# EasyEDA Pro project attenuator_evb.eprj

# Schematic Schematic1
Create Date: 2024-03-21; Page Name: P1; Project Name: attenuator_evb; Schematic Name: Schematic1; Update Date: 2024-04-02; Company: EasyEDA.com; Drawn: EasyEDA; Page Size: A4; Part Number: JLCPCB-002; Reviewed: EasyEDA; Version: V0.1
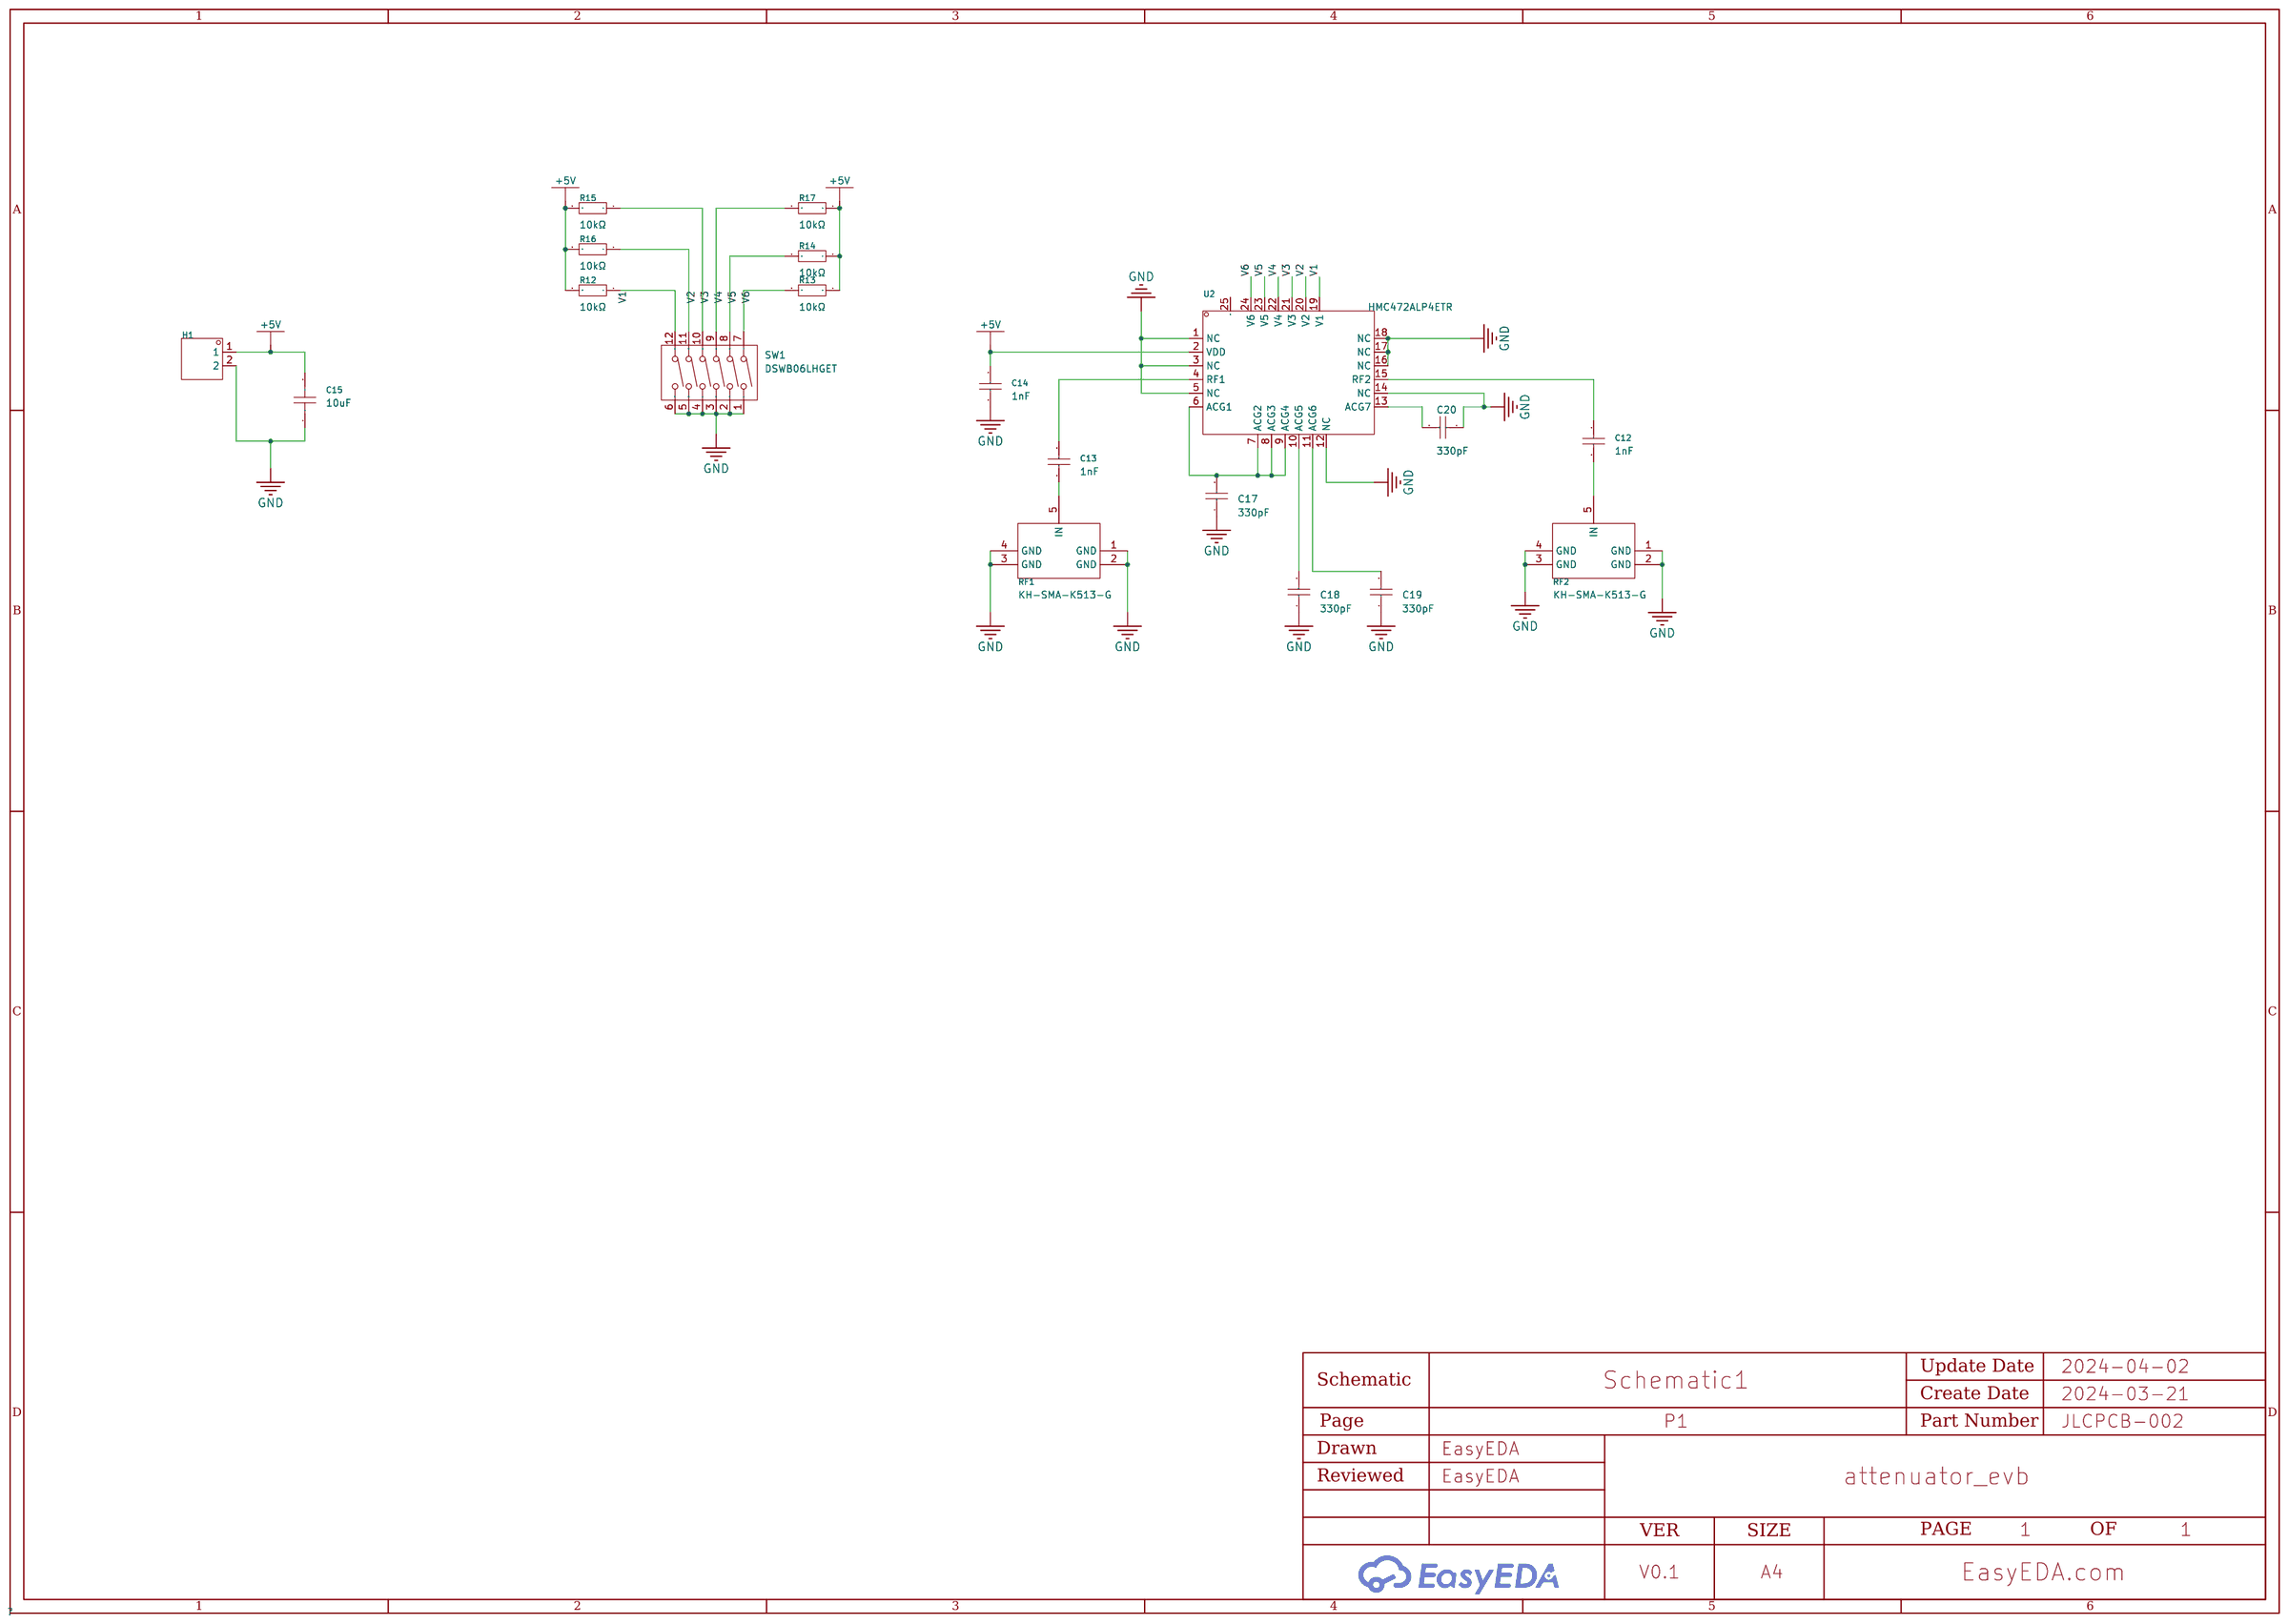
[diagram p0: schematic sheet]

## Parts
C12  1nF  [C0402]
C13  1nF  [C0402]
C14  1nF  [C0402]
C15  10uF  [C0603]
C17  330pF  [C0603]
C18  330pF  [C0603]
C19  330pF  [C0603]
C20  330pF  [C0603]
H1  -  [HDR-TH_2P-P2.54-V-M-1]  (no BOM)
R12  10kΩ  [R0603]
R13  10kΩ  [R0603]
R14  10kΩ  [R0603]
R15  10kΩ  [R0603]
R16  10kΩ  [R0603]
R17  10kΩ  [R0603]
RF1  KH-SMA-K513-G  [ANT-TH_KH-SMA-K513-G]
RF2  KH-SMA-K513-G  [ANT-TH_KH-SMA-K513-G]
SW1  DSWB06LHGET  [SW-TH_DSWB06LHGET]
U2  HMC472ALP4ETR  [QFN-24_L4.0-W4.0-P0.50-TL-EP2.7]

## Library data of the parts
C12-C14 = CC0402KRX7R9BB102: Capacitance: Tolerance:±10% Tolerance:±10% Voltage Rated: Temperature Coefficient:; LCSC Part Name: 1nF ±10% 50V; Supplier Part: C106205; Manufacturer: YAGEO(国巨); Supplier Footprint: 0402; JLCPCB Part Class: Extended Part; Datasheet: https://atta.szlcsc.com/upload/public/pdf/source/20181008/C309510_22F155564471FAF6A489F7D68F34234E.pdf; Supplier: LCSC; Tolerance: ±10%
C15 = CL10A106MP8NNNC: Capacitance: Tolerance:±20% Tolerance:±20% Voltage Rated: Temperature Coefficient:; LCSC Part Name: 10uF ±20% 10V; Supplier Part: C85713; Manufacturer: SAMSUNG(三星); Supplier Footprint: 0603; JLCPCB Part Class: Extended Part; Datasheet: https://atta.szlcsc.com/upload/public/pdf/source/20160218/1457707763339.pdf; Supplier: LCSC; Tolerance: ±20%
C17-C20 = 0603B331K500NT: Capacitance: Tolerance:±10% Tolerance:±10% Voltage Rated: Temperature Coefficient:; LCSC Part Name: 330pF ±10% 50V; Supplier Part: C1612; Manufacturer: FH(风华); Supplier Footprint: 0603; JLCPCB Part Class: Extended Part; Datasheet: https://atta.szlcsc.com/upload/public/pdf/source/20200305/C486355_26A10D38EF8C2A5C37091D0039909270.pdf; Supplier: LCSC; Tolerance: ±10%
H1 = HDR-M_2.54_1x2P: Supplier Footprint: Through
R12-R17 = 0603WAF1002T5E: Type:Thick Film Resistors Resistance:10kΩ Tolerance:±1% Tolerance:±1% Power(Watts): Overload Voltage (Max): Temperature Coefficient:±100ppm/℃ Temperature Coefficient:±100ppm/℃ Operating Temperature Range:-55℃~+155℃ Operating Temperature Range:-55℃~+155℃; LCSC Part Name: 厚膜电阻 10kΩ ±1% 100mW; Supplier Part: C25804; Manufacturer: UNI-ROYAL(厚声); Supplier Footprint: 0603; JLCPCB Part Class: Basic Part; Datasheet: https://atta.szlcsc.com/upload/public/pdf/source/20200306/C422600_1E6D84923E4A46A82E41ADD87F860B5C.pdf; Supplier: LCSC; Type: Thick Film Resistors; Tolerance: ±1%; Temperature Coefficient: ±100ppm/℃; Operating Temperature Range: -55℃~+155℃
RF1 RF2 = KH-SMA-K513-G: Connector Type:板端 Interface Type:内孔 Number of Ports:1 Interface Diameter:- Interface Length/Height:- Frequency-Max:6GHz RF Series:SMA Impedance:50Ω Style:弯头 Operating Temperature Range:-55℃~+155℃ Operating Temperature Range:-55℃~+155℃; LCSC Part Name: SMA 内孔 弯头; Supplier Part: C411575; Manufacturer: kinghelm(金航标); Supplier Footprint: 插件; JLCPCB Part Class: Extended Part; Datasheet: https://atta.szlcsc.com/upload/public/pdf/source/20210317/C411575_49039CD64129040639EC5218E5A2C783.pdf; Supplier: LCSC; Connector Type: 板端; Interface Type: 内孔; Number of Ports: 1; Frequency-Max: 6GHz; RF Series: SMA; Impedance: 50Ω; Style: 弯头; Operating Temperature Range: -55℃~+155℃
SW1 = DSWB06LHGET: Type:平拨,凸起式 Circuit:SPST Number of Positions:6Bit Lead Pitch:2.54mm Operating Life:- Color:Red; LCSC Part Name: 拨码开关,平拨开关,DSWB06LHGET; Supplier Part: C99416; Manufacturer: YE; Supplier Footprint: 插件; JLCPCB Part Class: Extended Part; Datasheet: https://atta.szlcsc.com/upload/public/pdf/source/20170330/1490855795233.pdf; Supplier: LCSC; Type: 平拨,凸起式; Circuit: SPST; Number of Positions: 6Bit; Lead Pitch: 2.54mm; Color: Red
U2 = HMC472ALP4ETR: Frequency Range:0Hz~3.8GHz Frequency Range:0Hz~3.8GHz Power (Watts):560mW Impedance:50Ω Attenuation Value:0.5dB~31.5dB Attenuation Value:0.5dB~31.5dB Operating Temperature:-40℃~+85℃ Operating Temperature:-40℃~+85℃; LCSC Part Name: 宽带6位 GaAs IC数字衰减器; Supplier Part: C208585; Manufacturer: ADI(亚德诺); Supplier Footprint: QFN-24-EP(4x4); JLCPCB Part Class: Extended Part; Datasheet: https://atta.szlcsc.com/upload/public/pdf/source/20180416/C209364_D034942268ABB16FFE091F729F253F30.pdf; Supplier: LCSC; Frequency Range: 0Hz~3.8GHz; Power (Watts): 560mW; Impedance: 50Ω; Attenuation Value: 0.5dB~31.5dB; Operating Temperature: -40℃~+85℃

## Nets
+5V: C14.2 C15.2 H1.1 R12.2 R13.1 R14.1 R15.2 R16.2 R17.1 U2.2(VDD)
GND: C14.1 C15.1 C17.1 C18.1 C19.1 C20.1 H1.2 RF1.1(GND) RF1.2(GND) RF1.3(GND) RF1.4(GND) RF2.1(GND) RF2.2(GND) RF2.3(GND) RF2.4(GND) SW1.1 SW1.2 SW1.3 SW1.4 SW1.5 SW1.6 U2.1(NC) U2.3(NC) U2.5(NC) U2.12(NC) U2.14(NC) U2.16(NC) U2.17(NC) U2.18(NC)
V1: R12.1 SW1.12 U2.19(V1)
V2: R16.1 SW1.11 U2.20(V2)
V3: R15.1 SW1.10 U2.21(V3)
V4: R17.2 SW1.9 U2.22(V4)
V5: R14.2 SW1.8 U2.23(V5)
V6: R13.2 SW1.7 U2.24(V6)
$1N3362: C13.1 RF1.5(IN)
$1N3366: C13.2 U2.4(RF1)
$1N3370: C12.2 U2.15(RF2)
$1N3377: C12.1 RF2.5(IN)
$1N10696: C17.2 U2.6(ACG1) U2.7(ACG2) U2.8(ACG3) U2.9(ACG4)
$1N10794: C18.2 U2.10(ACG5)
$1N10806: C19.2 U2.11(ACG6)
$1N10842: C20.2 U2.13(ACG7)

Not connected (* = marked no-connect by the designer): U2 25

# Board PCB1
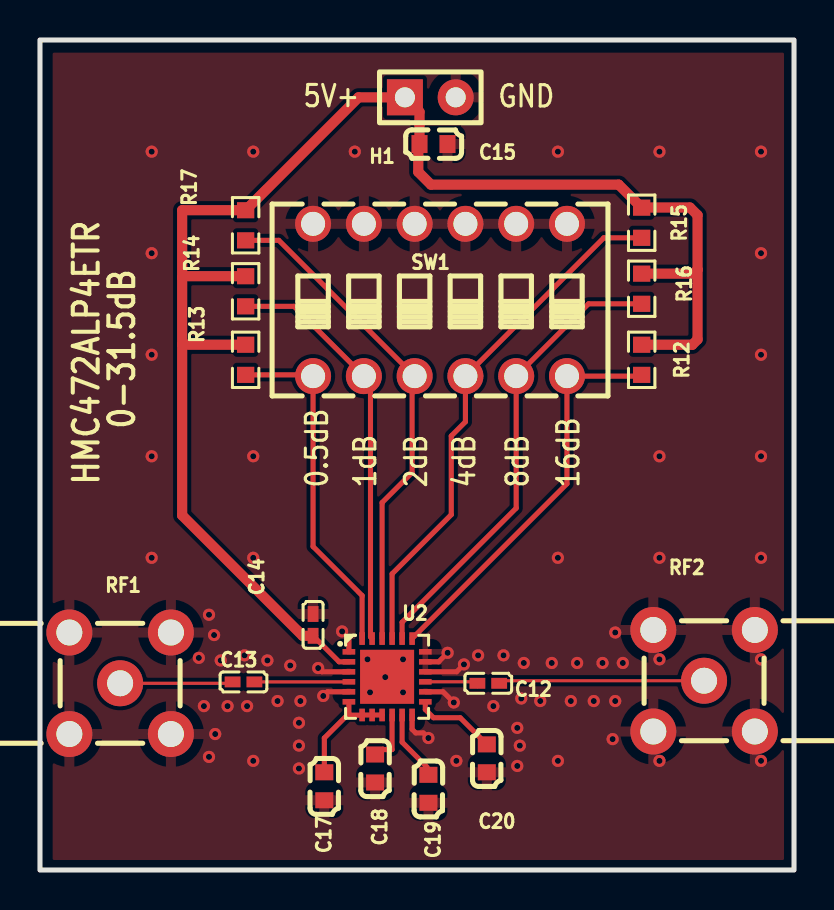
[diagram p1: board, top side]
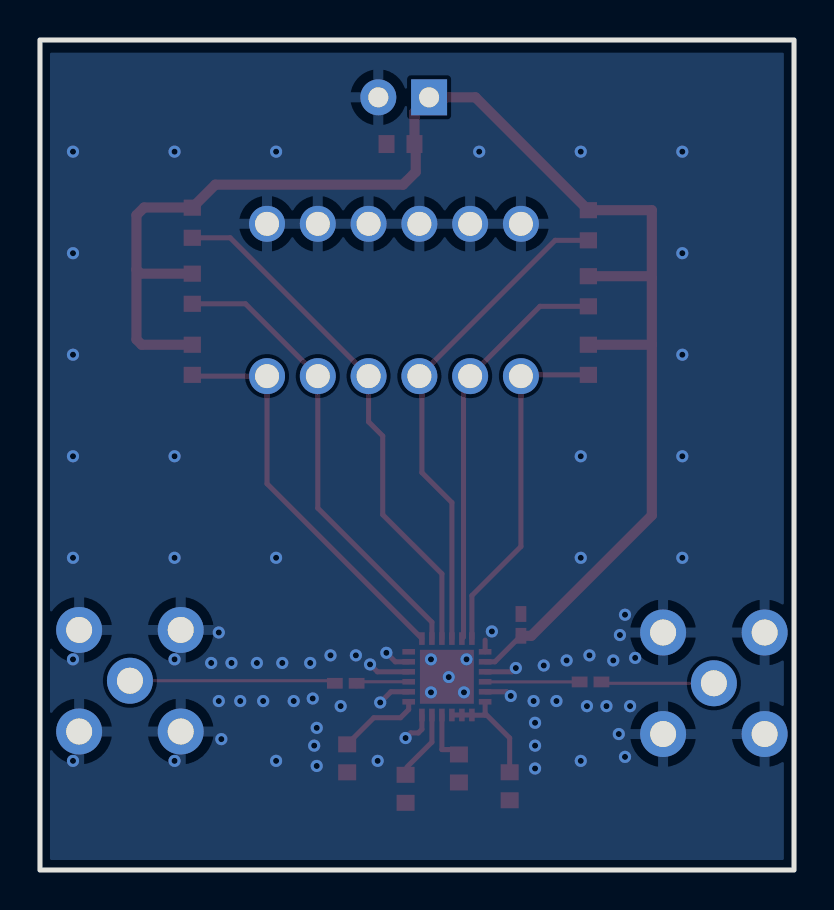
[diagram p2: board, bottom side, seen from below]

Outline 37.72 x 41.53 mm; copper layers: Top Layer, Inner1, Inner2, Bottom Layer. Coordinates in mm from the lower left corner of the outline.
Outline path: rectangle 0,41.53 37.72,0
Stack: Top Layer 0.035mm 外层铜厚1oz / Dielectric1 0.0994mm 3313 RC57% 4.2mil / Inner1 0.0152mm 内层铜厚 / Dielectric2 1.265mm 1.3mm H/HOZ 含铜 / Inner2 0.0152mm 内层铜厚 / Dielectric3 0.0994mm 3313 RC57% 4.2mil / Bottom Layer 0.035mm 外层铜厚1oz

## Design rules (mm)
template: JLCPCB Capability(Two Layers Board)
spacing copperThickness1oz (default): track to track 0.102, other pairs 0.152 to 0.3
spacing copperThickness2oz: track to track 0.203, other pairs 0.152 to 0.3
track width copperThickness1oz (default): min 0.127, default 0.254, max 2.54
track width copperThickness2oz: min 0.203, default 0.254, max 2.54
differential pair differentialPair (default): width min 0.127, default 0.254, max 2.54; gap min 0.152, default 0.152
via viaSize (default): diameter min 0.5, default 0.61, max 10; hole min 0.3, default 0.305, max 6.3

## Placement (name value [footprint] x y rotation side)
C12  1nF  [C0402]  22.42 9.34 180 top
C13  1nF  [C0402]  10.18 9.41 0 top
C14  1nF  [C0402]  13.66 12.26 270 top
C15  10uF  [C0603]  19.69 36.32 180 top
C17  330pF  [C0603]  14.22 4.19 90 top
C18  330pF  [C0603]  16.76 5.08 90 top
C19  330pF  [C0603]  19.43 4.06 90 top
C20  330pF  [C0603]  22.35 5.59 90 top
H1  -  [HDR-TH_2P-P2.54-V-M-1]  19.53 38.66 0 top
R12  10kΩ  [R0603]  30.1 25.53 90 top
R13  10kΩ  [R0603]  10.29 25.53 270 top
R14  10kΩ  [R0603]  10.29 28.96 270 top
R15  10kΩ  [R0603]  30.1 32.39 90 top
R16  10kΩ  [R0603]  30.1 29.08 90 top
R17  10kΩ  [R0603]  10.29 32.26 270 top
RF1  KH-SMA-K513-G  [ANT-TH_KH-SMA-K513-G]  4.01 9.34 0 top
RF2  KH-SMA-K513-G  [ANT-TH_KH-SMA-K513-G]  33.22 9.47 180 top
SW1  DSWB06LHGET  [SW-TH_DSWB06LHGET]  20.01 28.52 0 top
U2  HMC472ALP4ETR  [QFN-24_L4.0-W4.0-P0.50-TL-EP2.7]  17.36 9.67 0 top

## Footprints (pads in the part's own frame, mm; a bottom-side part is the same pattern mirrored in y, then rotated)
ANT-TH_KH-SMA-K513-G
  round 2.3 hole 1.3: 1(-2.54,-2.54) 2(-2.54,2.54) 3(2.54,2.54) 4(2.54,-2.54) 5(0,0)
C0402
  rect 0.79x0.54 smd: 1(-0.545,0) 2(0.545,0)
C0603
  rect 0.8x0.9 smd: 1(-0.7,0) 2(0.7,0)
HDR-TH_2P-P2.54-V-M-1
  rect 1.8x1.8 hole 1: 1(-1.27,0)
  round 1.8 hole 1: 2(1.27,0)
QFN-24_L4.0-W4.0-P0.50-TL-EP2.7
  rect 0.633x0.28 smd: 1(-1.911,1.25) 2(-1.911,0.75) 3(-1.911,0.25) 4(-1.911,-0.25) 5(-1.911,-0.75) 6(-1.911,-1.25) 13(1.911,-1.25) 14(1.911,-0.75) 15(1.911,-0.25) 16(1.911,0.25) 17(1.911,0.75) 18(1.911,1.25)
  rect 0.28x0.633 smd: 7(-1.25,-1.911) 8(-0.75,-1.911) 9(-0.25,-1.911) 10(0.25,-1.911) 11(0.75,-1.911) 12(1.25,-1.911) 19(1.25,1.911) 20(0.75,1.911) 21(0.25,1.911) 22(-0.25,1.911) 23(-0.75,1.911) 24(-1.25,1.911)
  rect 2.7x2.7 smd: 25(0,0)
R0603
  rect 0.806x0.864 smd: 1(-0.753,0) 2(0.753,0)
SW-TH_DSWB06LHGET
  round 1.8 hole 1.2: 1(-6.35,3.81) 2(-3.81,3.81) 3(-1.27,3.81) 4(1.27,3.81) 5(3.81,3.81) 6(6.35,3.81) 7(-6.35,-3.81) 8(-3.81,-3.81) 9(-1.27,-3.81) 10(1.27,-3.81) 11(3.81,-3.81) 12(6.35,-3.81)

## Nets
As in the schematic.

Pads without a net: U2 25

## Via types
v1: diameter 0.61, hole 0.305, Top Layer to Bottom Layer, 73 vias

## Routing (per net, layer and track width the routed paths; a pad name or vN(x,y) marks a point on that pad's centre or on a via; arc(x,y) is an arc through that point)
+5V: length 77.2
  Top Layer w0.254: 15.45,10.42 14.96,10.42 C14.2
  Top Layer w0.508: 32.89,30.04 32.89,26.54 32.63,26.28 R12.2 ; 32.89,30.04 32.69,29.84 R16.2 ; 32.89,30.04 32.89,32.77 32.51,33.15 30.11,33.15 R15.2 28.95,34.29 19.56,34.29 18.92,34.93 18.92,36.09 18.95,36.12 ; R14.1 7.19,29.71 7.11,29.63 ; R13.1 7.12,26.28 7.11,26.29 ; 7.11,29.63 7.11,26.29 ; 7.11,29.63 7.11,33.01 R17.1 15.93,38.66 H1.1 18.98,37.93 C15.2 ; 7.11,26.29 7.11,17.74 13.14,11.72 C14.2
GND: length 10.3
  Top Layer w0.254: U2.16 20.84,9.92 v1(21.21,10.29) ; 15.45,8.92 14.38,8.92 v1(14.17,8.71) ; 15.45,10.92 15.45,11.5 ; U2.17 19.94,10.42 v1(20.39,10.87) ; v1(13.92,10.11) 14.1,9.92 15.45,9.92 ; U2.14 20.16,8.92 v1(20.7,8.38) ; 18.61,7.76 18.61,7.04 18.8,6.86 19.18,6.86 v1(19.43,6.6)
  vias: v1(5.59,35.94) v1(5.59,30.86) v1(5.59,25.78) v1(5.59,20.7) v1(5.59,15.62) v1(7.95,10.61) v1(8.2,8.2) v1(8.45,12.77) v1(8.45,5.66) v1(8.71,11.76) v1(8.77,6.8) v1(9.04,10.49) v1(9.38,8.2) v1(10.23,10.74) v1(10.36,8.2) v1(10.67,35.94) v1(10.67,20.7) v1(10.67,15.62) v1(10.67,5.46) v1(11.38,10.49) v1(11.88,8.45) v1(12.52,10.23) v1(13.03,8.45) v1(12.95,7.37) v1(12.95,6.22) v1(12.95,5.08) v1(15.11,11.94) v1(15.75,35.94) v1(16.38,10.54) v1(16.51,8.89) v1(17.27,9.65) v1(18.16,10.54) v1(18.16,8.89) v1(20.83,5.46) v1(21.92,10.74) v1(22.68,8.2) v1(23.19,10.74) v1(23.88,7.11) v1(23.88,5.21) v1(24,6.22) v1(24.08,8.58) v1(24.2,10.36) v1(25.03,8.45) v1(25.6,10.36) v1(25.91,35.94) v1(25.91,15.62) v1(25.91,5.46) v1(26.56,8.45) v1(26.87,10.36) v1(27.7,8.45) v1(28.14,10.36) v1(28.65,6.55) v1(28.77,11.88) v1(28.77,8.45) v1(29.16,10.36) v1(30.99,35.94) v1(30.99,20.7) v1(30.99,15.62) v1(30.99,10.54) v1(30.99,5.46) v1(36.07,35.94) v1(36.07,30.86) v1(36.07,25.78) v1(36.07,20.7) v1(36.07,15.62) v1(36.07,10.54) v1(36.07,5.46)
V1: length 20.1
  Top Layer w0.254: 18.61,11.58 26.36,19.33 SW1.12 30.04,24.71 R12.1
V2: length 23.3
  Top Layer w0.254: U2.20 18.11,12.4 23.82,18.11 SW1.11 27.44,28.33 R16.1
V3: length 26.2
  Top Layer w0.254: 29.97,31.63 28.2,31.63 SW1.10 21.28,22.42 20.57,21.72 20.57,17.78 17.61,14.82 17.61,11.58
V4: length 25.1
  Top Layer w0.254: R17.2 11.95,31.5 SW1.9 18.61,24.58 18.61,19.88 17.11,18.38 U2.22
V5: length 20.7
  Top Layer w0.254: 16.61,11.58 16.53,11.66 16.53,24.38 SW1.8 12.71,28.2 R14.2
V6: length 17.5
  Top Layer w0.254: R13.2 13.6,24.77 SW1.7 13.66,16.18 16.11,13.73 U2.24
$1N3362: length 5.7
  Top Layer w0.157: RF1.5 9.57,9.34 C13.1
$1N3366: length 4.7
  Top Layer w0.157: C13.2 15.44,9.41 15.45,9.42
$1N3370: length 2.7
  Top Layer w0.157: 21.68,9.42 U2.15
  Top Layer w0.254: 21.88,9.22 21.68,9.42
$1N3377: length 10.4
  Top Layer w0.157: 22.97,9.22 23.22,9.47 RF2.5
$1N10696: length 5.8
  Top Layer w0.254: 15.45,8.42 15.45,7.83 ; 15.45,7.83 15.45,7.75 16.1,7.75 U2.7 U2.9 ; 15.45,7.83 14.22,6.6 C17.2
$1N10794: length 2.2
  Top Layer w0.254: 17.14,6.03 17.15,6.03 17.61,6.03 17.61,7.76
$1N10806: length 3.1
  Top Layer w0.254: 19.37,5.15 18.11,6.4 U2.11
$1N10842: length 4.2
  Top Layer w0.254: C20.2 21.02,7.62 19.69,7.62 19.28,8.03 U2.13

## Copper pours and planes (outline as drawn; the poured copper is in the pictures)
GND on Top Layer: 0.63,40.89 37.47,40.89 37.47,0.38 0.63,0.38
GND on Bottom Layer: 0.51,40.89 37.47,40.89 37.47,0.38 0.51,0.38
GND on Inner1: 0.51,40.89 37.08,40.89 37.08,0.38 0.51,0.38
GND on Inner2: 0.51,40.77 37.08,40.77 37.08,0.38 0.51,0.38

## Text on the board
Top Silkscreen Layer: 5V+ | GND | 0.5dB | 1dB | 2dB | 4dB | 8dB | 16dB | HMC472ALP4ETR | 0-31.5dB
